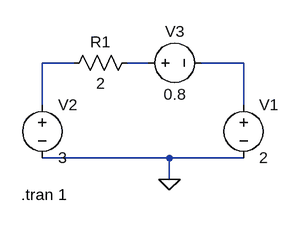
[diagram p0: schematic Q2.asc]
Q2.asc, the LTspice schematic file:
Version 4
SHEET 1 880 680
WIRE 80 64 32 64
WIRE 192 64 160 64
WIRE 336 64 272 64
WIRE 32 128 32 64
WIRE 336 128 336 64
WIRE 224 208 32 208
WIRE 336 208 224 208
WIRE 224 240 224 208
FLAG 224 240 0
SYMBOL voltage 336 112 R0
WINDOW 123 0 0 Left 0
WINDOW 39 0 0 Left 0
SYMATTR InstName V1
SYMATTR Value 2
SYMBOL voltage 32 112 R0
WINDOW 123 0 0 Left 0
WINDOW 39 0 0 Left 0
SYMATTR InstName V2
SYMATTR Value 3
SYMBOL voltage 176 64 R270
WINDOW 0 32 56 VTop 2
WINDOW 3 -32 56 VBottom 2
WINDOW 123 0 0 Left 0
WINDOW 39 0 0 Left 0
SYMATTR InstName V3
SYMATTR Value 0.8
SYMBOL res 176 48 R90
WINDOW 0 0 56 VBottom 2
WINDOW 3 32 56 VTop 2
SYMATTR InstName R1
SYMATTR Value 2
TEXT 0 264 Left 2 !.tran 1

The netlist it stands for:
* Q2.asc
V1 N003 0 2
V2 N001 0 3
V3 N002 N003 0.8
R1 N002 N001 2
.tran 1
.backanno
.end